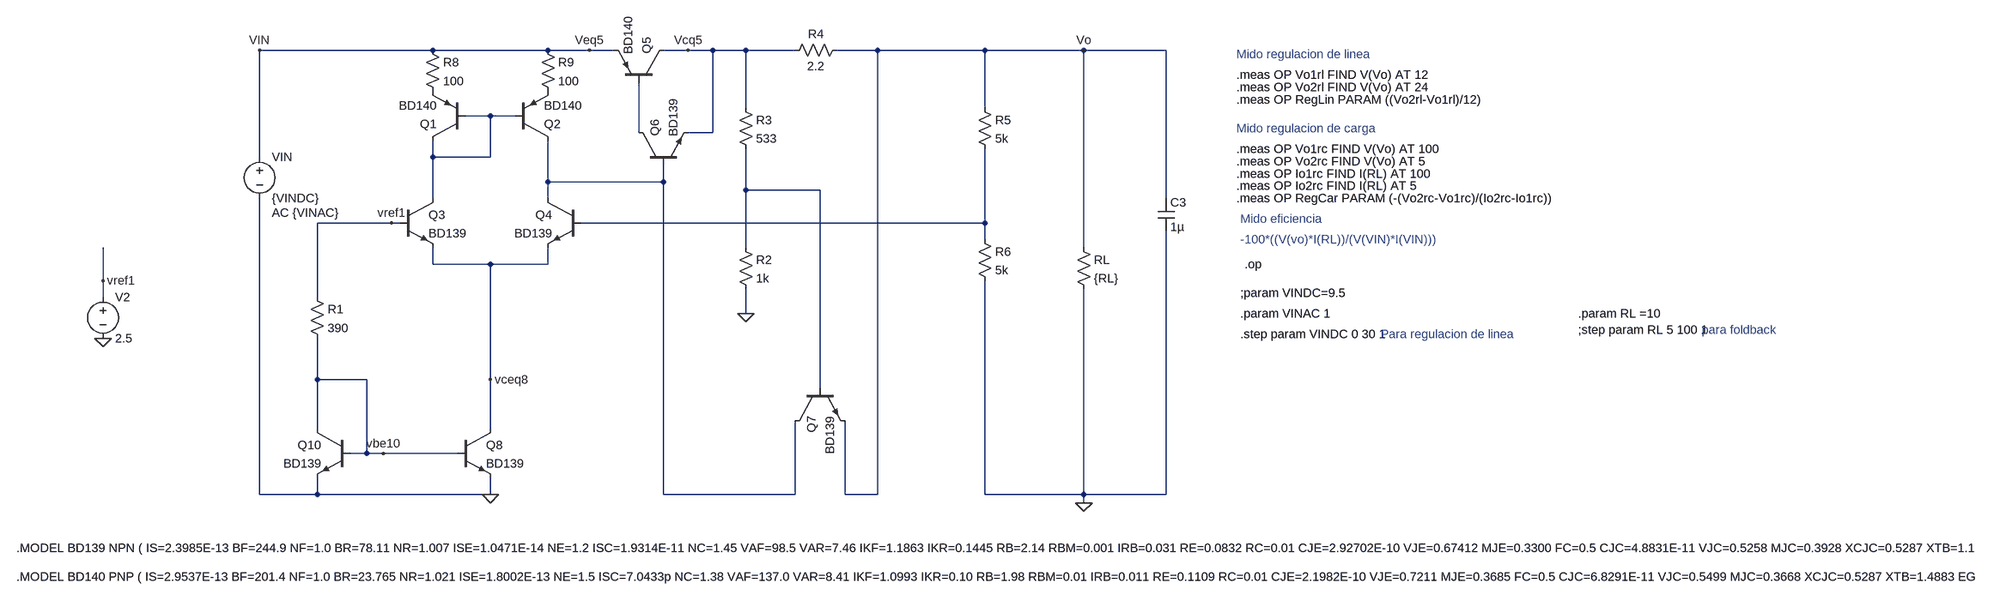
[diagram p0: schematic Regulador Lineal_V2.asc]
Regulador Lineal_V2.asc, the LTspice schematic file:
Version 4.1
SHEET 1 3580 1080
WIRE 96 -32 -240 -32
WIRE 320 -32 96 -32
WIRE 400 -32 320 -32
WIRE 448 -32 400 -32
WIRE 592 -32 544 -32
WIRE 640 -32 592 -32
WIRE 704 -32 640 -32
WIRE 800 -32 704 -32
WIRE 960 -32 880 -32
WIRE 1168 -32 960 -32
WIRE 1360 -32 1168 -32
WIRE 1520 -32 1360 -32
WIRE 704 80 704 -32
WIRE 1168 80 1168 -32
WIRE 208 96 160 96
WIRE 256 96 208 96
WIRE 496 128 496 32
WIRE 640 128 640 -32
WIRE 640 128 592 128
WIRE -240 176 -240 -32
WIRE 96 176 96 144
WIRE 208 176 208 96
WIRE 208 176 96 176
WIRE 320 224 320 144
WIRE 544 224 544 192
WIRE 544 224 320 224
WIRE 704 240 704 160
WIRE 848 240 704 240
WIRE 96 256 96 176
WIRE 320 256 320 224
WIRE 1520 256 1520 -32
WIRE 16 304 -128 304
WIRE 32 304 16 304
WIRE 1168 304 1168 160
WIRE 1168 304 384 304
WIRE 1168 336 1168 304
WIRE 704 352 704 240
WIRE 1360 352 1360 -32
WIRE 96 384 96 352
WIRE 208 384 96 384
WIRE 320 384 320 352
WIRE 320 384 208 384
WIRE -544 416 -544 352
WIRE -544 448 -544 416
WIRE -128 448 -128 304
WIRE 704 480 704 432
WIRE -128 608 -128 528
WIRE -32 608 -128 608
WIRE 208 608 208 384
WIRE 848 624 848 240
WIRE -128 704 -128 608
WIRE 208 704 208 608
WIRE -32 752 -32 608
WIRE -32 752 -64 752
WIRE 0 752 -32 752
WIRE 144 752 0 752
WIRE -240 832 -240 256
WIRE -128 832 -128 800
WIRE -128 832 -240 832
WIRE 208 832 208 800
WIRE 208 832 -128 832
WIRE 544 832 544 224
WIRE 800 832 800 688
WIRE 800 832 544 832
WIRE 896 832 896 688
WIRE 960 832 960 -32
WIRE 960 832 896 832
WIRE 1168 832 1168 416
WIRE 1360 832 1360 432
WIRE 1360 832 1168 832
WIRE 1520 832 1520 320
WIRE 1520 832 1360 832
WIRE 1360 848 1360 832
FLAG 1360 -32 Vo
FLAG -240 -32 VIN
FLAG 1360 848 0
FLAG 208 832 0
FLAG 704 480 0
FLAG 0 752 vbe10
FLAG -544 416 vref1
FLAG -544 528 0
FLAG 16 304 vref1
FLAG 208 608 vceq8
FLAG 400 -32 Veq5
FLAG 592 -32 Vcq5
SYMBOL pnp 160 144 R180
SYMATTR InstName Q1
SYMATTR Value BD140
SYMBOL pnp 256 144 M180
SYMATTR InstName Q2
SYMATTR Value BD140
SYMBOL npn 32 256 R0
SYMATTR InstName Q3
SYMATTR Value BD139
SYMBOL npn 384 256 M0
SYMATTR InstName Q4
SYMATTR Value BD139
SYMBOL pnp 544 32 M270
SYMATTR InstName Q5
SYMATTR Value BD140
SYMBOL npn 496 192 R270
SYMATTR InstName Q6
SYMATTR Value BD139
SYMBOL voltage -240 160 R0
WINDOW 123 24 124 Left 2
WINDOW 39 0 0 Left 0
SYMATTR Value2 AC {VINAC}
SYMATTR InstName VIN
SYMATTR Value {VINDC}
SYMBOL res 80 -48 R0
SYMATTR InstName R8
SYMATTR Value 100
SYMBOL res 304 -48 R0
SYMATTR InstName R9
SYMATTR Value 100
SYMBOL cap 1504 256 R0
SYMATTR InstName C3
SYMATTR Value 1µ
SYMBOL res 688 64 R0
SYMATTR InstName R3
SYMATTR Value 533
SYMBOL res 688 336 R0
SYMATTR InstName R2
SYMATTR Value 1k
SYMBOL res 896 -48 R90
WINDOW 0 0 56 VBottom 2
WINDOW 3 32 56 VTop 2
SYMATTR InstName R4
SYMATTR Value 2.2
SYMBOL npn 800 624 M90
SYMATTR InstName Q7
SYMATTR Value BD139
SYMBOL res 1152 64 R0
SYMATTR InstName R5
SYMATTR Value 5k
SYMBOL res 1152 320 R0
SYMATTR InstName R6
SYMATTR Value 5k
SYMBOL npn 144 704 R0
SYMATTR InstName Q8
SYMATTR Value BD139
SYMBOL npn -64 704 M0
SYMATTR InstName Q10
SYMATTR Value BD139
SYMBOL res 1344 336 R0
SYMATTR InstName RL
SYMATTR Value {RL}
SYMBOL res -144 432 R0
SYMATTR InstName R1
SYMATTR Value 390
SYMBOL voltage -544 432 R0
WINDOW 123 0 0 Left 0
WINDOW 39 0 0 Left 0
SYMATTR InstName V2
SYMATTR Value 2.5
TEXT 1672 384 Left 2 !.op
TEXT 1656 -24 Left 2 ;Mido regulacion de linea
TEXT 1656 16 Left 2 !.meas OP Vo1rl FIND V(Vo) AT 12
TEXT 1656 40 Left 2 !.meas OP Vo2rl FIND V(Vo) AT 24
TEXT 1656 64 Left 2 !.meas OP RegLin PARAM ((Vo2rl-Vo1rl)/12)
TEXT 1656 120 Left 2 ;Mido regulacion de carga
TEXT 1656 160 Left 2 !.meas OP Vo1rc FIND V(Vo) AT 100
TEXT 1656 184 Left 2 !.meas OP Vo2rc FIND V(Vo) AT 5
TEXT 1656 208 Left 2 !.meas OP Io1rc FIND I(RL) AT 100
TEXT 1656 232 Left 2 !.meas OP Io2rc FIND I(RL) AT 5
TEXT 1664 296 Left 2 ;Mido eficiencia
TEXT 1664 336 Left 2 ;-100*((V(vo)*I(RL))/(V(VIN)*I(VIN)))
TEXT 1664 440 Left 2 !;param VINDC=9.5
TEXT 1664 480 Left 2 !.param VINAC 1
TEXT 1656 256 Left 2 !.meas OP RegCar PARAM (-(Vo2rc-Vo1rc)/(Io2rc-Io1rc))
TEXT 1664 520 Left 2 !.step param VINDC 0 30 1
TEXT -712 936 Left 2 !.MODEL BD139 NPN ( IS=2.3985E-13 BF=244.9 NF=1.0 BR=78.11 NR=1.007 ISE=1.0471E-14 NE=1.2 ISC=1.9314E-11 NC=1.45 VAF=98.5 VAR=7.46 IKF=1.1863 IKR=0.1445 RB=2.14 RBM=0.001 IRB=0.031 RE=0.0832 RC=0.01 CJE=2.92702E-10 VJE=0.67412 MJE=0.3300 FC=0.5 CJC=4.8831E-11 VJC=0.5258 MJC=0.3928 XCJC=0.5287 XTB=1.1398 EG=1.2105 XTI=3.0 Vceo=80 Icrating=3 mfg=fairchild)
TEXT -712 992 Left 2 !.MODEL BD140 PNP ( IS=2.9537E-13 BF=201.4 NF=1.0 BR=23.765 NR=1.021 ISE=1.8002E-13 NE=1.5 ISC=7.0433p NC=1.38 VAF=137.0 VAR=8.41 IKF=1.0993 IKR=0.10 RB=1.98 RBM=0.01 IRB=0.011 RE=0.1109 RC=0.01 CJE=2.1982E-10 VJE=0.7211 MJE=0.3685 FC=0.5 CJC=6.8291E-11 VJC=0.5499 MJC=0.3668 XCJC=0.5287 XTB=1.4883 EG=1.2343 XTI=3.0 Vceo=80 Icrating=3 mfg=fairchild)
TEXT 2320 512 Left 2 !;step param RL 5 100 1
TEXT 2560 512 Left 2 ;para foldback
TEXT 2320 480 Left 2 !.param RL =10
TEXT 1936 520 Left 2 ;Para regulacion de linea

The netlist it stands for:
* Regulador Lineal_V2.asc
Q1 N001 N001 P001 0 BD140
Q2 N003 N001 P002 0 BD140
Q3 N001 vref1 vceq8 0 BD139
Q4 N003 N005 vceq8 0 BD139
Q5 Vcq5 N002 Veq5 0 BD140
Q6 N002 N003 Vcq5 0 BD139
VIN Veq5 0 {VINDC} AC {VINAC}
R8 Veq5 P001 100
R9 Veq5 P002 100
C3 Vo 0 1µ
R3 Vcq5 N004 533
R2 N004 0 1k
R4 Vo Vcq5 2.2
Q7 N003 N004 Vo 0 BD139
R5 Vo N005 5k
R6 N005 0 5k
Q8 vceq8 vbe10 0 0 BD139
Q10 vbe10 vbe10 0 0 BD139
RL Vo 0 {RL}
R1 vref1 vbe10 390
V2 vref1 0 2.5
.model NPN NPN
.model PNP PNP
.lib standard.bjt
.op
* Mido regulacion de linea
.meas OP Vo1rl FIND V(Vo) AT 12
.meas OP Vo2rl FIND V(Vo) AT 24
.meas OP RegLin PARAM ((Vo2rl-Vo1rl)/12)
* Mido regulacion de carga
.meas OP Vo1rc FIND V(Vo) AT 100
.meas OP Vo2rc FIND V(Vo) AT 5
.meas OP Io1rc FIND I(RL) AT 100
.meas OP Io2rc FIND I(RL) AT 5
* Mido eficiencia
* -100*((V(vo)*I(RL))/(V(VIN)*I(VIN)))
;param VINDC=9.5
.param VINAC 1
.meas OP RegCar PARAM (-(Vo2rc-Vo1rc)/(Io2rc-Io1rc))
.step param VINDC 0 30 1
.MODEL BD139 NPN ( IS=2.3985E-13 BF=244.9 NF=1.0 BR=78.11 NR=1.007 ISE=1.0471E-14 NE=1.2 ISC=1.9314E-11 NC=1.45 VAF=98.5 VAR=7.46 IKF=1.1863 IKR=0.1445 RB=2.14 RBM=0.001 IRB=0.031 RE=0.0832 RC=0.01 CJE=2.92702E-10 VJE=0.67412 MJE=0.3300 FC=0.5 CJC=4.8831E-11 VJC=0.5258 MJC=0.3928 XCJC=0.5287 XTB=1.1398 EG=1.2105 XTI=3.0 Vceo=80 Icrating=3 mfg=fairchild)
.MODEL BD140 PNP ( IS=2.9537E-13 BF=201.4 NF=1.0 BR=23.765 NR=1.021 ISE=1.8002E-13 NE=1.5 ISC=7.0433p NC=1.38 VAF=137.0 VAR=8.41 IKF=1.0993 IKR=0.10 RB=1.98 RBM=0.01 IRB=0.011 RE=0.1109 RC=0.01 CJE=2.1982E-10 VJE=0.7211 MJE=0.3685 FC=0.5 CJC=6.8291E-11 VJC=0.5499 MJC=0.3668 XCJC=0.5287 XTB=1.4883 EG=1.2343 XTI=3.0 Vceo=80 Icrating=3 mfg=fairchild)
;step param RL 5 100 1
* para foldback
.param RL =10
* Para regulacion de linea
.backanno
.end